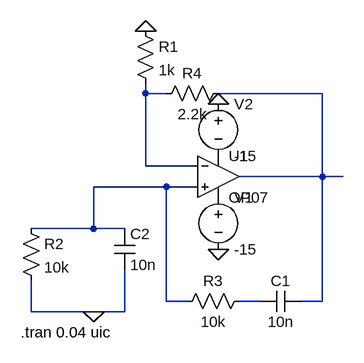
[diagram p0: schematic (13)wein bridge.asc]
(13)wein bridge.asc, the LTspice schematic file:
Version 4
SHEET 1 880 680
WIRE 144 32 144 16
WIRE 176 32 144 32
WIRE 416 32 256 32
WIRE 144 144 144 32
WIRE 224 144 144 144
WIRE 416 160 416 32
WIRE 416 160 288 160
WIRE 448 160 416 160
WIRE 176 176 64 176
WIRE 224 176 176 176
WIRE 64 240 64 176
WIRE 64 240 -32 240
WIRE 112 240 64 240
WIRE 176 352 176 176
WIRE 208 352 176 352
WIRE 320 352 288 352
WIRE 416 352 416 160
WIRE 416 352 384 352
WIRE -32 368 -32 320
WIRE 64 368 -32 368
WIRE 112 368 112 304
WIRE 112 368 64 368
FLAG 144 -64 0
FLAG 64 368 0
FLAG 256 48 0
FLAG 256 272 0
SYMBOL OpAmps\\OP07 256 96 R0
SYMATTR InstName U1
SYMBOL voltage 256 176 R0
WINDOW 123 0 0 Left 0
WINDOW 39 0 0 Left 0
SYMATTR InstName V1
SYMATTR Value -15
SYMBOL voltage 256 32 R0
WINDOW 123 0 0 Left 0
WINDOW 39 0 0 Left 0
SYMATTR InstName V2
SYMATTR Value -15
SYMBOL res 128 -80 R0
SYMATTR InstName R1
SYMATTR Value 1k
SYMBOL res -48 224 R0
SYMATTR InstName R2
SYMATTR Value 10k
SYMBOL res 304 336 R90
WINDOW 0 0 56 VBottom 2
WINDOW 3 32 56 VTop 2
SYMATTR InstName R3
SYMATTR Value 10k
SYMBOL cap 384 336 R90
WINDOW 0 0 32 VBottom 2
WINDOW 3 32 32 VTop 2
SYMATTR InstName C1
SYMATTR Value 10n
SYMBOL cap 96 240 R0
SYMATTR InstName C2
SYMATTR Value 10n
SYMBOL res 272 16 R90
WINDOW 0 0 56 VBottom 2
WINDOW 3 32 56 VTop 2
SYMATTR InstName R4
SYMATTR Value 2.2k
TEXT -48 400 Left 2 !.tran 0.04 uic

The netlist it stands for:
* (13)wein bridge.asc
XU1 N003 N001 P001 P002 N002 LT1001  ; OP07, pins In+ In- V+ V- OUT
V1 P002 0 -15
V2 0 P001 -15
R1 0 N001 1k
R2 N003 0 10k
R3 N004 N003 10k
C1 N002 N004 10n
C2 N003 0 10n
R4 N002 N001 2.2k
.tran 0.04 uic
.lib LTC.lib
.backanno
.end